# EasyEDA Pro project ProPrj_super_cap_ctrl_v1.0_2025-02-24.epro, board 控制板PCB
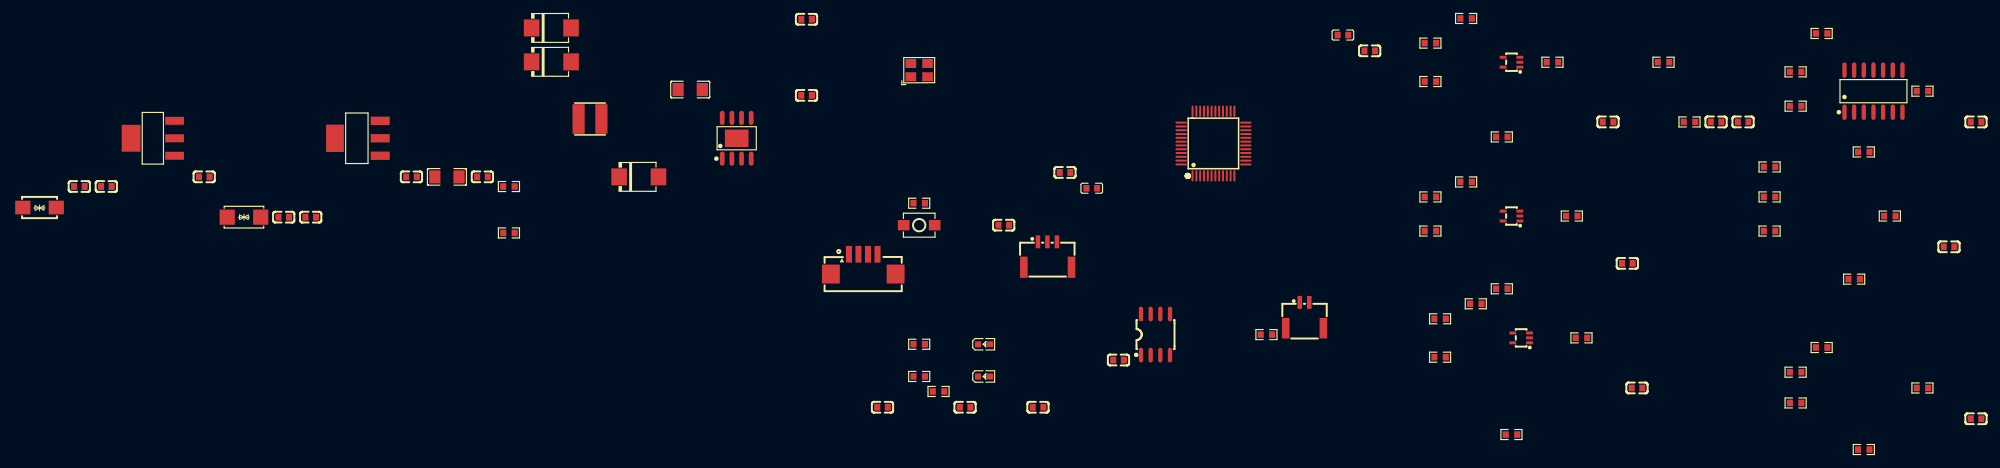
[diagram p12: board, top side]
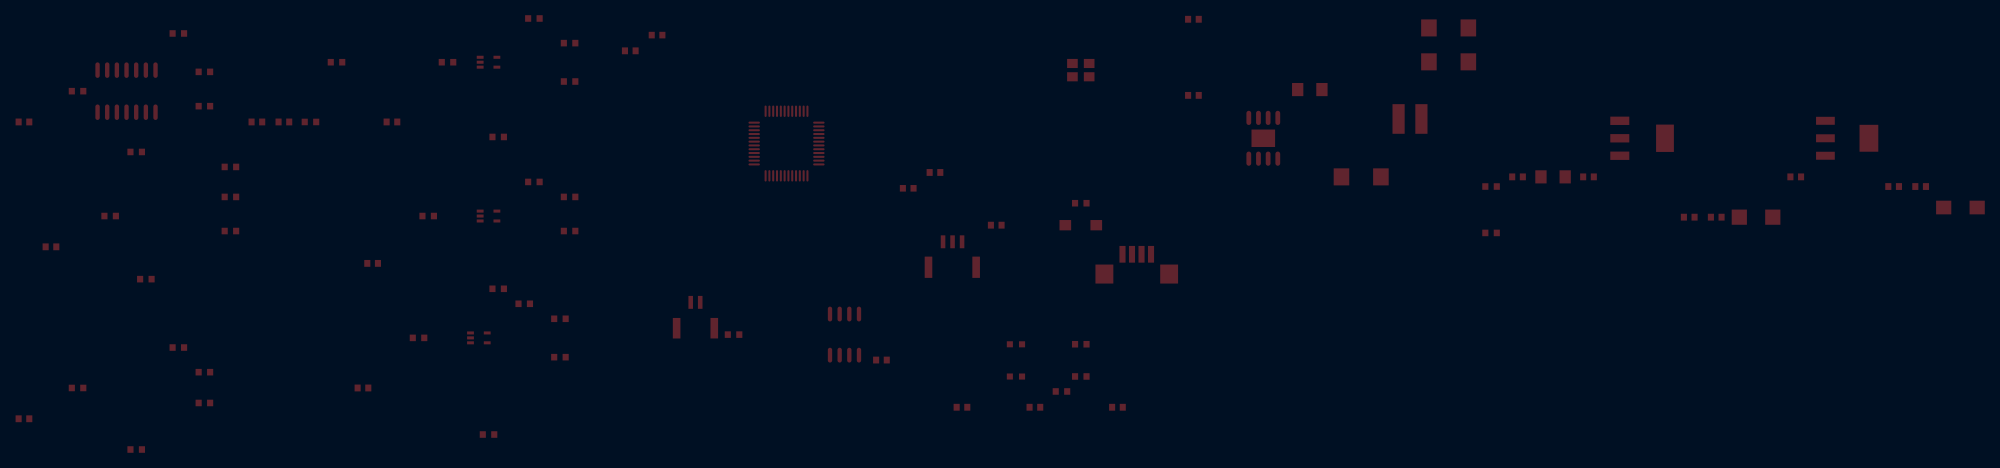
[diagram p13: board, bottom side, seen from below]

No outline. copper layers: Top Layer, Bottom Layer. Coordinates in mm from the lowest, leftmost part position.
Stack: Top Layer 0.035mm / Dielectric1 1.51mm FR4 er 4.5 / Bottom Layer 0.035mm

## Design rules (mm)
template: JLCPCB Capability(Two Layers Board)
spacing copperThickness1oz (default): track to track 0.102, other pairs 0.152 to 0.3
spacing copperThickness2oz: track to track 0.203, other pairs 0.152 to 0.3
track width copperThickness1oz (default): min 0.127, default 0.254, max 2.54
track width copperThickness2oz: min 0.203, default 0.254, max 2.54
differential pair differentialPair (default): width min 0.127, default 0.254, max 2.54; gap min 0.152, default 0.152
via viaSize (default): diameter min 0.5, default 0.61, max 10; hole min 0.3, default 0.305, max 6.3

## Placement (name value [footprint] x y rotation side)
C17  22pF  [C0603]  100.82 56.63 0 top
C18  22pF  [C0603]  100.82 46.61 0 top
C19  100nF  [C0603]  126.74 29.53 0 top
C54  100nF  [C0603]  141.83 11.78 0 top
C170  100nF  [C0603]  110.81 5.56 0 top
C171  100nF  [C0603]  121.66 5.56 0 top
C174  100nF  [C0603]  131.24 5.56 0 top
C175  100nF  [C0603]  134.79 36.46 0 top
C176  100nF  [C0603]  174.84 52.47 0 top
C177  10nF  [C0603]  206.17 43.11 0 top
C178  10nF  [C0603]  254.54 43.11 0 top
C179  10nF  [C0603]  254.54 4.05 0 top
C180  100nF  [C0603]  220.37 43.11 0 top
C181  100nF  [C0603]  223.92 43.11 0 top
C182  10nF  [C0603]  209.98 8.1 0 top
C184  10nF  [C0603]  208.71 24.5 0 top
C185  10uF  [C1206]  85.52 47.38 0 top
C186  100nF  [C0603]  5.23 34.62 0 top
C187  47uF  [C1206]  53.55 35.89 0 top
C188  100nF  [C0603]  48.89 35.89 0 top
C189  100nF  [C0603]  21.65 35.89 0 top
C190  10uF  [C0603]  8.78 34.62 0 top
C191  100nF  [C0603]  32.1 30.58 0 top
C192  10uF  [C0603]  35.65 30.58 0 top
C194  10nF  [C0603]  250.99 26.68 0 top
CN1  HC-1.25-4PWT  [CONN-SMD_4P-P1.25-HC-1.25-4PWT]  108.27 24.4 0 top
D1  SS510  [SMB_L4.3-W3.6-LS5.4-RD]  78.77 35.89 0 top
D2  SMAJ5.0CA  [SMA_L4.4-W2.8-LS5.1-BI]  0 31.85 0 top
D3  SMAJ3.3CA  [SMA_L4.3-W2.6-LS5.1-BI]  26.87 30.58 0 top
D5  SS510  [SMB_L4.3-W3.6-LS5.4-RD]  67.27 55.49 0 top
D6  SS510  [SMB_L4.3-W3.6-LS5.4-RD]  67.27 51.03 0 top
L2  10uH  [L0603]  138.31 34.38 0 top
L3  10uH  [L0603]  171.32 54.54 0 top
L4  100uH  [IND-SMD_L4.0-W4.0_FNR40XXS]  72.35 43.51 0 top
LED1  -  [LED_0603]  124.2 9.62 0 top
LED2  -  [LED_0603]  124.2 13.86 0 top
R13  10K  [R0603]  115.62 32.42 0 top
R14  10K  [R0603]  115.62 13.86 0 top
R15  10K  [R0603]  115.62 9.62 0 top
R16  10K  [R0603]  118.17 7.64 0 top
R108  1K  [R0603]  182.82 53.49 0 top
R109  1K  [R0603]  182.82 48.44 0 top
R110  1K  [R0603]  198.87 50.98 0 top
R111  7.5k  [R0603]  192.21 41.14 0 top
R112  7.5K  [R0603]  187.51 56.73 0 top
R113  15K  [R0603]  230.82 49.71 0 top
R114  15K  [R0603]  230.82 45.19 0 top
R115  1K  [R0603]  234.25 54.76 0 top
R116  1K  [R0603]  239.79 39.17 0 top
R117  1K  [R0603]  247.5 47.17 0 top
R118  15K  [R0603]  230.82 10.18 0 top
R119  15K  [R0603]  230.82 6.13 0 top
R120  1K  [R0603]  234.25 13.42 0 top
R121  1K  [R0603]  239.79 0 0 top
R122  1K  [R0603]  247.5 8.1 0 top
R123  10K  [R0603]  213.46 50.98 0 top
R124  10K  [R0603]  216.88 43.11 0 top
R125  1K  [R0603]  184.09 17.21 0 top
R126  1K  [R0603]  184.09 12.15 0 top
R127  13.3K  [R0603]  202.68 14.69 0 top
R128  7.5k  [R0603]  193.48 1.97 0 top
R129  7.5K  [R0603]  188.78 19.18 0 top
R135  1K  [R0603]  182.82 33.24 0 top
R136  1K  [R0603]  182.82 28.76 0 top
R137  13.3K  [R0603]  201.41 30.73 0 top
R138  7.5k  [R0603]  192.21 21.15 0 top
R139  7.5K  [R0603]  187.51 35.22 0 top
R140  30K  [R0603]  61.7 34.62 0 top
R141  4.7K  [R0603]  61.7 28.51 0 top
R145  1K  [R0603]  227.4 37.19 0 top
R146  15K  [R0603]  227.4 33.24 0 top
R147  15K  [R0603]  227.4 28.76 0 top
R148  1K  [R0603]  238.52 22.42 0 top
R149  1K  [R0603]  243.21 30.73 0 top
R150  120R  [R0603]  161.27 15.13 0 top
SW1  轻触按键3*4*H  [SW-SMD_L4.0-W2.9-LS5.0]  115.62 29.53 0 top
U4  STM32F334C8T6  [LQFP-48_L7.0-W7.0-P0.50-LS9.0-BL]  154.31 40.27 0 top
U10  -  [SOIC-8_L5.0-W4.0-P1.27-LS6.0-BL]  146.69 15.13 0 top
U11  GH1.25-2P卧贴  [CONN-SMD_2P-P1.25_GH1.25-2P]  166.28 17.67 0 top
U18  XL7005A  [SOIC-8_L4.9-W3.9-P1.27-LS6.0-BL-EP3.1-1]  91.64 40.97 0 top
U19  33nF  [C0603]  58.22 35.89 0 top
U20  AMS1117-5.0  [SOT-223_L6.5-W3.5-P2.30-LS7.0-BR]  14.89 40.97 0 top
U21  AMS1117-3.3  [SOT-223-3_L6.5-W3.4-P2.30-LS7.0-BR]  41.81 40.97 0 top
U25  TLV521DCKR  [SC-70-5_L2.1-W1.3-P0.65-LS2.1-BR]  194.75 14.69 0 top
U26  TLV521DCKR  [SC-70-5_L2.1-W1.3-P0.65-LS2.1-BR]  193.48 30.73 0 top
U27  TLV521DCKR  [SC-70-5_L2.1-W1.3-P0.65-LS2.1-BR]  193.48 50.98 0 top
U31  TLV521DCKR  [SOIC-14_L8.7-W3.9-P1.27-LS6.0-BL]  241.06 47.17 0 top
U34  GH1.25-3P卧贴  [CONN-SMD_GH1.25-3P]  132.51 25.67 0 top
X2  8MHz  [OSC-SMD_4P-L3.2-W2.5-BL]  115.62 49.93 0 top

## Footprints (pads in the part's own frame, mm; a bottom-side part is the same pattern mirrored in y, then rotated)
C0603
  rect 0.8x0.9 smd: 1(-0.7,0) 2(0.7,0)
C1206
  rect 1.485x1.728 smd: 1(-1.593,0) 2(1.593,0)
CONN-SMD_2P-P1.25_GH1.25-2P
  rect 0.6x1.7 smd: 1(-0.625,1.702) 2(0.625,1.702)
  rect 1x2.7 smd: 3(2.475,-1.702) 4(-2.475,-1.698)
CONN-SMD_4P-P1.25-HC-1.25-4PWT
  rect 0.8x2.2 smd: 1(-1.875,1.3) 2(-0.625,1.3) 3(0.625,1.3) 4(1.875,1.3)
  rect 2.35x2.5 smd: 5(4.255,-1.3) 6(-4.255,-1.3)
CONN-SMD_GH1.25-3P
  rect 0.6x1.7 smd: 1(-1.282,1.675) 2(-0.032,1.675) 3(1.218,1.675)
  rect 1x2.8 smd: 4(-3.132,-1.675) 5(3.132,-1.675)
IND-SMD_L4.0-W4.0_FNR40XXS
  rect 1.6x3.9 smd: 1(-1.5,0) 2(1.5,0)
L0603
  rect 0.8x0.864 smd: 1(-0.7,0) 2(0.7,0)
LED_0603
  rect 0.8x0.8 smd: 1(-0.851,-0.01) 2(0.75,-0.005)
LQFP-48_L7.0-W7.0-P0.50-LS9.0-BL
  oval 0.27x1.5 smd: 1(-2.75,-4.25) 2(-2.25,-4.25) 3(-1.75,-4.25) 4(-1.25,-4.25) 5(-0.75,-4.25) 6(-0.25,-4.25) 7(0.25,-4.25) 8(0.75,-4.25) 9(1.25,-4.25) 10(1.75,-4.25) 11(2.25,-4.25) 12(2.75,-4.25) 25(2.75,4.25) 26(2.25,4.25) 27(1.75,4.25) 28(1.25,4.25) 29(0.75,4.25) 30(0.25,4.25) 31(-0.25,4.25) 32(-0.75,4.25) 33(-1.25,4.25) 34(-1.75,4.25) 35(-2.25,4.25) 36(-2.75,4.25)
  oval 1.5x0.27 smd: 13(4.25,-2.75) 14(4.25,-2.25) 15(4.25,-1.75) 16(4.25,-1.25) 17(4.25,-0.75) 18(4.25,-0.25) 19(4.25,0.25) 20(4.25,0.75) 21(4.25,1.25) 22(4.25,1.75) 23(4.25,2.25) 24(4.25,2.75) 37(-4.25,2.75) 38(-4.25,2.25) 39(-4.25,1.75) 40(-4.25,1.25) 41(-4.25,0.75) 42(-4.25,0.25) 43(-4.25,-0.25) 44(-4.25,-0.75) 45(-4.25,-1.25) 46(-4.25,-1.75) 47(-4.25,-2.25) 48(-4.25,-2.75)
OSC-SMD_4P-L3.2-W2.5-BL
  rect 1.4x1.2 smd: 1(-1.1,-0.875) 2(1.1,-0.875) 3(1.1,0.875) 4(-1.1,0.875)
R0603
  rect 0.806x0.864 smd: 1(-0.753,0) 2(0.753,0)
SC-70-5_L2.1-W1.3-P0.65-LS2.1-BR
  rect 0.9x0.4 smd: 1(1.1,-0.65) 2(1.1,0) 3(1.1,0.65) 4(-1.1,0.65) 5(-1.1,-0.65)
SMA_L4.3-W2.6-LS5.1-BI
  rect 2x2 smd: 1(-2.2,0) 2(2.2,0)
SMA_L4.4-W2.8-LS5.1-BI
  rect 2x1.8 smd: 1(-2.2,0) 2(2.2,0)
SMB_L4.3-W3.6-LS5.4-RD
  rect 2.047x2.241 smd: 1(-2.591,0) 2(2.591,0)
SOIC-8_L4.9-W3.9-P1.27-LS6.0-BL-EP3.1-1
  oval 0.63x1.865 smd: 1(-1.905,-2.683) 2(-0.635,-2.683) 3(0.635,-2.683) 4(1.905,-2.683) 5(1.905,2.683) 6(0.635,2.683) 7(-0.635,2.683) 8(-1.905,2.683)
  rect 3.1x2.3 smd: 9(0,0)
SOIC-8_L5.0-W4.0-P1.27-LS6.0-BL
  oval 0.569x1.95 smd: 1(-1.905,-2.705) 2(-0.635,-2.705) 3(0.635,-2.705) 4(1.905,-2.705) 5(1.905,2.705) 6(0.635,2.705) 7(-0.635,2.705) 8(-1.905,2.705)
SOIC-14_L8.7-W3.9-P1.27-LS6.0-BL
  oval 0.574x2.038 smd: 1(-3.81,-2.769) 2(-2.54,-2.769) 3(-1.27,-2.769) 4(0,-2.769) 5(1.27,-2.769) 6(2.54,-2.769) 7(3.81,-2.769) 8(3.81,2.769) 9(2.54,2.769) 10(1.27,2.769) 11(0,2.769) 12(-1.27,2.769) 13(-2.54,2.769) 14(-3.81,2.769)
SOT-223-3_L6.5-W3.4-P2.30-LS7.0-BR
  rect 2.5x1.1 smd: 1(2.97,-2.3) 2(2.97,0) 3(2.97,2.3)
  rect 2.34x3.6 smd: 4(-2.97,0)
SOT-223_L6.5-W3.5-P2.30-LS7.0-BR
  rect 2.465x1.05 smd: 1(2.857,-2.3) 2(2.857,0) 3(2.857,2.3)
  rect 2.465x3.54 smd: 4(-2.857,0)
SW-SMD_L4.0-W2.9-LS5.0
  rect 1.53x1.36 smd: 1(-2.035,0) 2(2.035,0)

## Nets
GND: C17.2 C18.2 C19.2 C54.2 C170.1 C171.1 C174.1 C175.2 C176.1 C177.1 C178.1 C179.1 C180.1 C181.1 C182.1 C184.1 C185.2 C186.1 C187.1 C188.1 C189.1 C190.1 C191.1 C192.1 C194.1 CN1.3 CN1.5 CN1.6 D1.2 D2.1 D3.1 LED2.1 R16.1 R108.1 R114.1 R115.2 R120.2 R124.1 R125.1 R135.1 R141.1 R145.1 SW1.1 U4.8 U4.23 U4.35 U4.47 U10.2 U10.8 U11.3 U11.4 U18.5 U18.6 U18.7 U18.8 U18.9 U20.1 U21.1 U25.2 U26.2 U27.2 U31.11 U34.3 U34.4 U34.5 X2.2 X2.4
VBAT+: D5.2 R146.1
VBAT-: R136.1 R147.1
VCC_1.65V_OPAMP: C181.2 R112.2 R129.2 R139.2 U31.8 U31.9
VCC_3.3V: C170.2 C171.2 C174.2 C175.1 C191.2 C192.2 CN1.4 D3.2 L2.1 L3.1 R13.2 R14.1 R15.1 U4.1 U4.24 U4.36 U4.48 U21.2 U21.4
VCC_3.3V_OPAMP: C176.2 L3.2 R123.1 U31.4
VCC_5V: C54.1 C186.2 C190.2 D2.2 U10.3 U20.2 U20.4 U25.5 U26.5 U27.5
VCC_9.5V: C187.2 C188.2 C189.2 L4.1 R140.2 U19.2 U20.3 U21.3
VDDA: L2.2 U4.9
BOOT0: R16.2 U4.44
CAN-H: R150.2 U10.7 U11.2
CAN-L: R150.1 U10.6 U11.1
CAN_RX(PA11): U4.32 U10.4
CAN_TX(PA12): U4.33 U10.1
HRTIM1_CHA1: U4.29
HRTIM1_CHA2: U4.30
HRTIM1_CHD1: U4.27
HRTIM1_CHD2: U4.28
I_BAT_DETC(PB12): C184.2 R137.2 U4.25
I_CAP_DETC(PB2): C182.2 R127.2 U4.20
I_CHASSIS_DETC(PB13): C177.2 R110.2 U4.26
LED_TEST: LED1.1 U4.2
NRST: C19.1 R13.1 SW1.2 U4.7
OSC_IN: C17.1 U4.5 X2.1
OSC_OUT: C18.1 U4.6 X2.3
SWCLK: CN1.2 U4.37
SWDIO: CN1.1 U4.34
USART2_RX: U4.40 U34.2
USART2_TX: U4.39 U34.1
V_BAT_DETC(PA3): C194.2 R149.2 U4.13
V_CAP_DETC(PA4): C179.2 R122.1 U4.14
V_CHASIS_DETC(PB0): C178.2 R117.1 U4.18
VCAP+: D6.2 R118.1
VCAP-: R119.1 R126.1
VCHASSIS+: R113.1
VCHASSIS-: R109.1
$1N1104: LED2.2 R14.2
$1N1105: LED1.2 R15.2
$2N1564: R108.2 R112.1 U27.3
$2N1568: R109.2 R111.1 U27.4
$2N1569: R110.1 R111.2 U27.1
$2N1572: R114.2 R116.2 U31.2
$2N1573: R116.1 R117.2 U31.1
$2N1578: R118.2 R120.1 U31.12
$2N1579: R119.2 R121.2 U31.13
$2N1580: R121.1 R122.2 U31.14
$2N1589: R125.2 R129.1 U25.3
$2N1593: R126.2 R128.1 U25.4
$2N1594: R127.1 R128.2 U25.1
$2N1597: R135.2 R139.1 U26.3
$2N1601: R136.2 R138.1 U26.4
$2N1602: R137.1 R138.2 U26.1
$2N1612: R145.2 R146.2 U31.5
$2N1615: R147.2 R148.1 U31.6
$2N1616: R148.2 R149.1 U31.7
$2N1630: R113.2 R115.1 U31.3
$2N1651: C180.2 R123.2 R124.2 U31.10
$3N701: D1.1 L4.2 U18.2
$3N707: R140.1 R141.2 U18.3 U19.1
$3N721: C185.1 D5.1 D6.1 U18.1

Pads without a net: U4 3 4 10 11 12 15 16 17 19 21 22 31 38 41 42 43 45 46; U10 5; U18 4
